# Altium schematic sheet BPDC high.SchDoc
size A
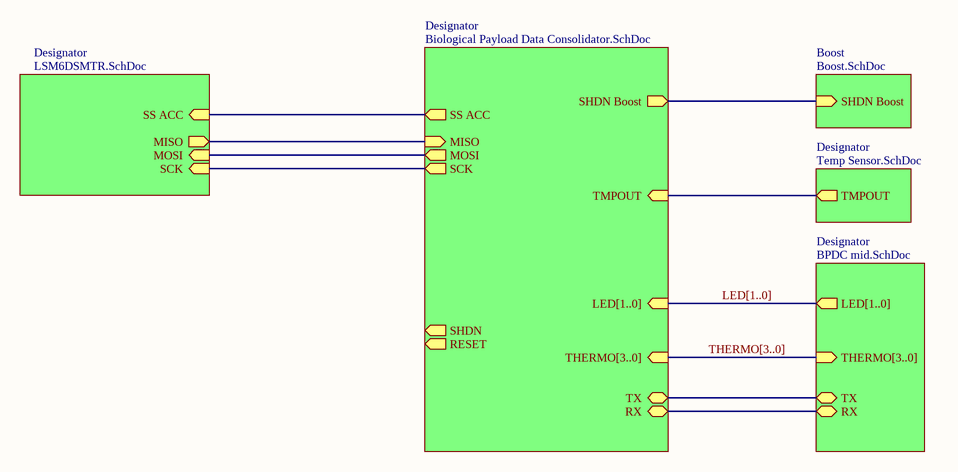
[diagram p0: BPDC high.SchDoc]

## Sub-sheets
Boost = Boost.SchDoc: SHDN Boost (in)
Designator = LSM6DSMTR.SchDoc: MOSI (in), MISO (out), SCK (in), SS ACC (in)
Designator = Biological Payload Data Consolidator.SchDoc: THERMO[3..0] (in), MOSI (out), SS ACC (out), SCK (out), TMPOUT (in), LED[1..0] (in), RESET (out), MISO (in), SHDN (out), SHDN Boost (out), TX (bidir), RX (bidir)
Designator = Temp Sensor.SchDoc: TMPOUT (out)
Designator = BPDC mid.SchDoc: THERMO[3..0] (in), LED[1..0] (out), RX (bidir), TX (bidir)

## Nets
(unnamed): sheet Designator/MOSI, sheet Designator/MOSI
(unnamed): sheet Designator/MISO, sheet Designator/MISO
(unnamed): sheet Designator/SCK, sheet Designator/SCK
(unnamed): sheet Designator/SS ACC, sheet Designator/SS ACC
(unnamed): sheet Designator/TMPOUT, sheet Designator/TMPOUT
(unnamed): sheet Designator/SHDN Boost, sheet Boost/SHDN Boost
(unnamed): sheet Designator/TX, sheet Designator/TX
(unnamed): sheet Designator/RX, sheet Designator/RX

## Buses and harness runs
bus LED[1..0] = sheet Designator/LED[1..0]
bus THERMO[3..0] = sheet Designator/THERMO[3..0]